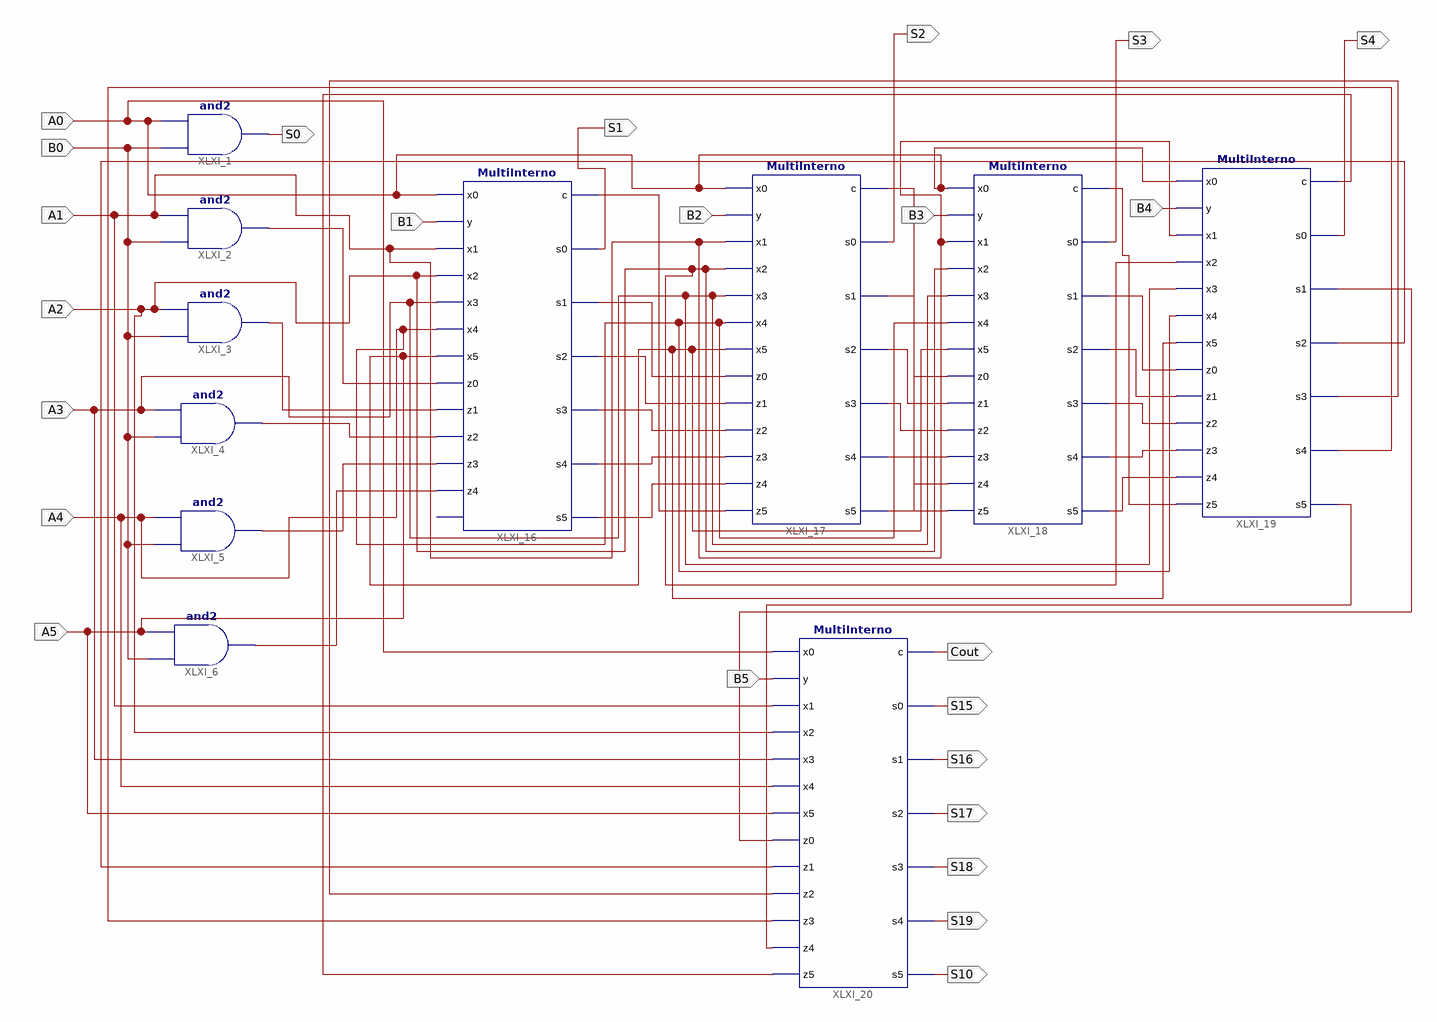
[diagram p0: schematic sheet 1]
// Xilinx ISE schematic Multiplicador.sch (spartan3e) as structural Verilog: 11 symbols, 24 ports
module Multiplicador (
  input  A0,
  input  B0,
  input  A1,
  input  A2,
  input  A3,
  input  A4,
  input  A5,
  input  B1,
  input  B2,
  input  B3,
  input  B4,
  input  B5,
  output S0,
  output S1,
  output S3,
  output S4,
  output S2,
  output S15,
  output Cout,
  output S16,
  output S17,
  output S18,
  output S19,
  output S10
);

  wire c, S5, S6, S7, S8, S9, XLXN_29, XLXN_30, XLXN_31, XLXN_32, XLXN_33, XLXN_34, XLXN_37, XLXN_38,
       XLXN_39, XLXN_40, XLXN_41, XLXN_52, XLXN_53, XLXN_54, XLXN_55, XLXN_56, XLXN_57, XLXN_58, XLXN_59,
       XLXN_60, XLXN_61, XLXN_62, XLXN_63;

  and XLXI_1 (S0, B0, A0);
  and XLXI_2 (XLXN_29, B0, A1);
  and XLXI_3 (XLXN_30, B0, A2);
  and XLXI_4 (XLXN_31, B0, A3);
  and XLXI_5 (XLXN_32, B0, A4);
  and XLXI_6 (XLXN_33, B0, A5);
  MultiInterno XLXI_16 (
    .x0(A0), .y(B1), .x1(A1), .x2(A2), .x3(A3), .x4(A4), .x5(A5), .z0(XLXN_29), .z1(XLXN_30), .z2(XLXN_31),
    .z3(XLXN_32), .z4(XLXN_33), .c(XLXN_34), .s0(S1), .s1(XLXN_37), .s2(XLXN_38), .s3(XLXN_39), .s4(XLXN_40),
    .s5(XLXN_41));  // open: z5
  MultiInterno XLXI_17 (
    .x0(A0), .y(B2), .x1(A1), .x2(A2), .x3(A3), .x4(A4), .x5(A5), .z0(XLXN_37), .z1(XLXN_38), .z2(XLXN_39),
    .z3(XLXN_40), .z4(XLXN_41), .z5(XLXN_34), .c(XLXN_52), .s0(S2), .s1(XLXN_54), .s2(XLXN_55), .s3(XLXN_56),
    .s4(XLXN_57), .s5(XLXN_58));
  MultiInterno XLXI_18 (
    .x0(A0), .y(B3), .x1(A1), .x2(A2), .x3(A3), .x4(A4), .x5(A5), .z0(XLXN_54), .z1(XLXN_55), .z2(XLXN_56),
    .z3(XLXN_57), .z4(XLXN_58), .z5(XLXN_52), .c(XLXN_53), .s0(S3), .s1(XLXN_59), .s2(XLXN_60), .s3(XLXN_61),
    .s4(XLXN_62), .s5(XLXN_63));
  MultiInterno XLXI_19 (
    .x0(A0), .y(B4), .x1(A1), .x2(A2), .x3(A3), .x4(A4), .x5(A5), .z0(XLXN_59), .z1(XLXN_60), .z2(XLXN_61),
    .z3(XLXN_62), .z4(XLXN_63), .z5(XLXN_53), .c(c), .s0(S4), .s1(S5), .s2(S6), .s3(S7), .s4(S8), .s5(S9));
  MultiInterno XLXI_20 (
    .x0(A0), .y(B5), .x1(A1), .x2(A2), .x3(A3), .x4(A4), .x5(A5), .z0(S5), .z1(S6), .z2(S7), .z3(S8),
    .z4(S9), .z5(c), .c(Cout), .s0(S15), .s1(S16), .s2(S17), .s3(S18), .s4(S19), .s5(S10));
endmodule
